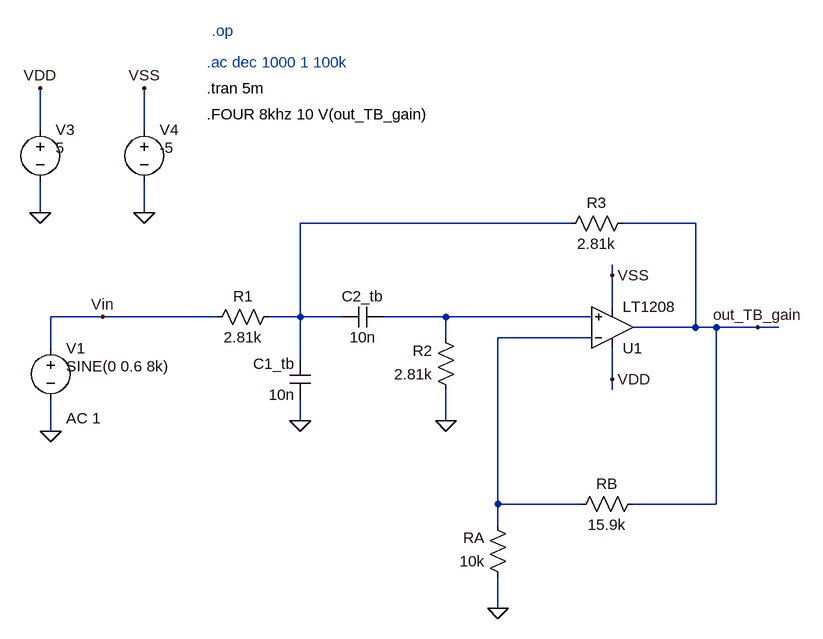
[diagram p0: schematic ETAJUL 2 FTB SALLEN KEY.asc]
ETAJUL 2 FTB SALLEN KEY.asc, the LTspice schematic file:
Version 4
SHEET 1 2932 1708
WIRE 752 -192 752 -256
WIRE 912 -192 912 -256
WIRE 752 -64 752 -112
WIRE 912 -64 912 -112
WIRE 1568 -48 1152 -48
WIRE 1760 -48 1648 -48
WIRE 1632 32 1632 16
WIRE 1632 80 1632 32
WIRE 848 96 768 96
WIRE 1024 96 848 96
WIRE 1152 96 1152 -48
WIRE 1152 96 1104 96
WIRE 1216 96 1152 96
WIRE 1376 96 1280 96
WIRE 1600 96 1376 96
WIRE 1760 112 1760 -48
WIRE 1760 112 1664 112
WIRE 1792 112 1760 112
WIRE 1856 112 1792 112
WIRE 1888 112 1856 112
WIRE 1376 128 1376 96
WIRE 1600 128 1456 128
WIRE 768 144 768 96
WIRE 1152 160 1152 96
WIRE 1632 192 1632 144
WIRE 1632 208 1632 192
WIRE 1152 256 1152 224
WIRE 1376 256 1376 208
WIRE 768 272 768 224
WIRE 1456 384 1456 128
WIRE 1584 384 1456 384
WIRE 1792 384 1792 112
WIRE 1792 384 1664 384
WIRE 1456 416 1456 384
WIRE 1456 544 1456 496
FLAG 752 -64 0
FLAG 912 -64 0
FLAG 752 -256 VDD
FLAG 912 -256 VSS
FLAG 768 272 0
FLAG 1856 112 out_TB_gain
FLAG 1632 32 VSS
FLAG 1632 192 VDD
FLAG 848 96 Vin
FLAG 1376 256 0
FLAG 1152 256 0
FLAG 1456 544 0
DATAFLAG 928 96 ""
DATAFLAG 1184 96 ""
DATAFLAG 1456 96 ""
DATAFLAG 1536 128 ""
DATAFLAG 1728 112 ""
SYMBOL voltage 752 -208 R0
WINDOW 123 24 124 Left 2
WINDOW 39 0 0 Left 2
WINDOW 3 24 44 Left 2
SYMATTR Value 5
SYMATTR InstName V3
SYMBOL voltage 912 -208 R0
WINDOW 123 24 124 Left 2
WINDOW 39 0 0 Left 2
WINDOW 3 24 44 Left 2
SYMATTR Value -5
SYMATTR InstName V4
SYMBOL voltage 768 128 R0
WINDOW 123 24 124 Left 2
WINDOW 39 0 0 Left 2
WINDOW 3 24 44 Left 2
SYMATTR Value2 AC 1
SYMATTR Value SINE(0 0.6 8k)
SYMATTR InstName V1
SYMBOL cap 1168 160 M0
SYMATTR InstName C1_tb
SYMATTR Value 10n
SYMBOL cap 1216 112 R270
WINDOW 0 32 32 VTop 2
WINDOW 3 0 32 VBottom 2
SYMATTR InstName C2_tb
SYMATTR Value 10n
SYMBOL res 1680 368 R90
WINDOW 0 0 56 VBottom 2
WINDOW 3 32 56 VTop 2
SYMATTR InstName RB
SYMATTR Value 15.9k
SYMBOL res 1472 512 R180
WINDOW 0 36 76 Left 2
WINDOW 3 36 40 Left 2
SYMATTR InstName RA
SYMATTR Value 10k
SYMBOL OpAmps\\LT1208 1632 176 M180
SYMATTR InstName U1
SYMBOL res 1120 80 R90
WINDOW 0 0 56 VBottom 2
WINDOW 3 32 56 VTop 2
SYMATTR InstName R1
SYMATTR Value 2.81k
SYMBOL res 1392 224 R180
WINDOW 0 36 76 Left 2
WINDOW 3 36 40 Left 2
SYMATTR InstName R2
SYMATTR Value 2.81k
SYMBOL res 1552 -32 R270
WINDOW 0 32 56 VTop 2
WINDOW 3 0 56 VBottom 2
SYMATTR InstName R3
SYMATTR Value 2.81k
TEXT 1008 -296 Left 2 ;.ac dec 1000 1 100k
TEXT 1016 -344 Left 2 ;.op
TEXT 1008 -256 Left 2 !.tran 5m
TEXT 1008 -216 Left 2 !.FOUR 8khz 10 V(out_TB_gain)

The netlist it stands for:
* ETAJUL 2 FTB SALLEN KEY.asc
V3 VDD 0 5
V4 VSS 0 -5
V1 Vin 0 SINE(0 0.6 8k) AC 1
C1_tb N001 0 10n
C2_tb N001 N002 10n
RB out_TB_gain N003 15.9k
RA 0 N003 10k
XU1 N002 N003 VDD VSS out_TB_gain LT1208  ; pins In+ In- V+ V- OUT
R1 N001 Vin 2.81k
R2 0 N002 2.81k
R3 N001 out_TB_gain 2.81k
* .ac dec 1000 1 100k
* .op
.tran 5m
.FOUR 8khz 10 V(out_TB_gain)
.backanno
.end